# EAGLE design esp_thermometer (EAGLE 8.4.3)
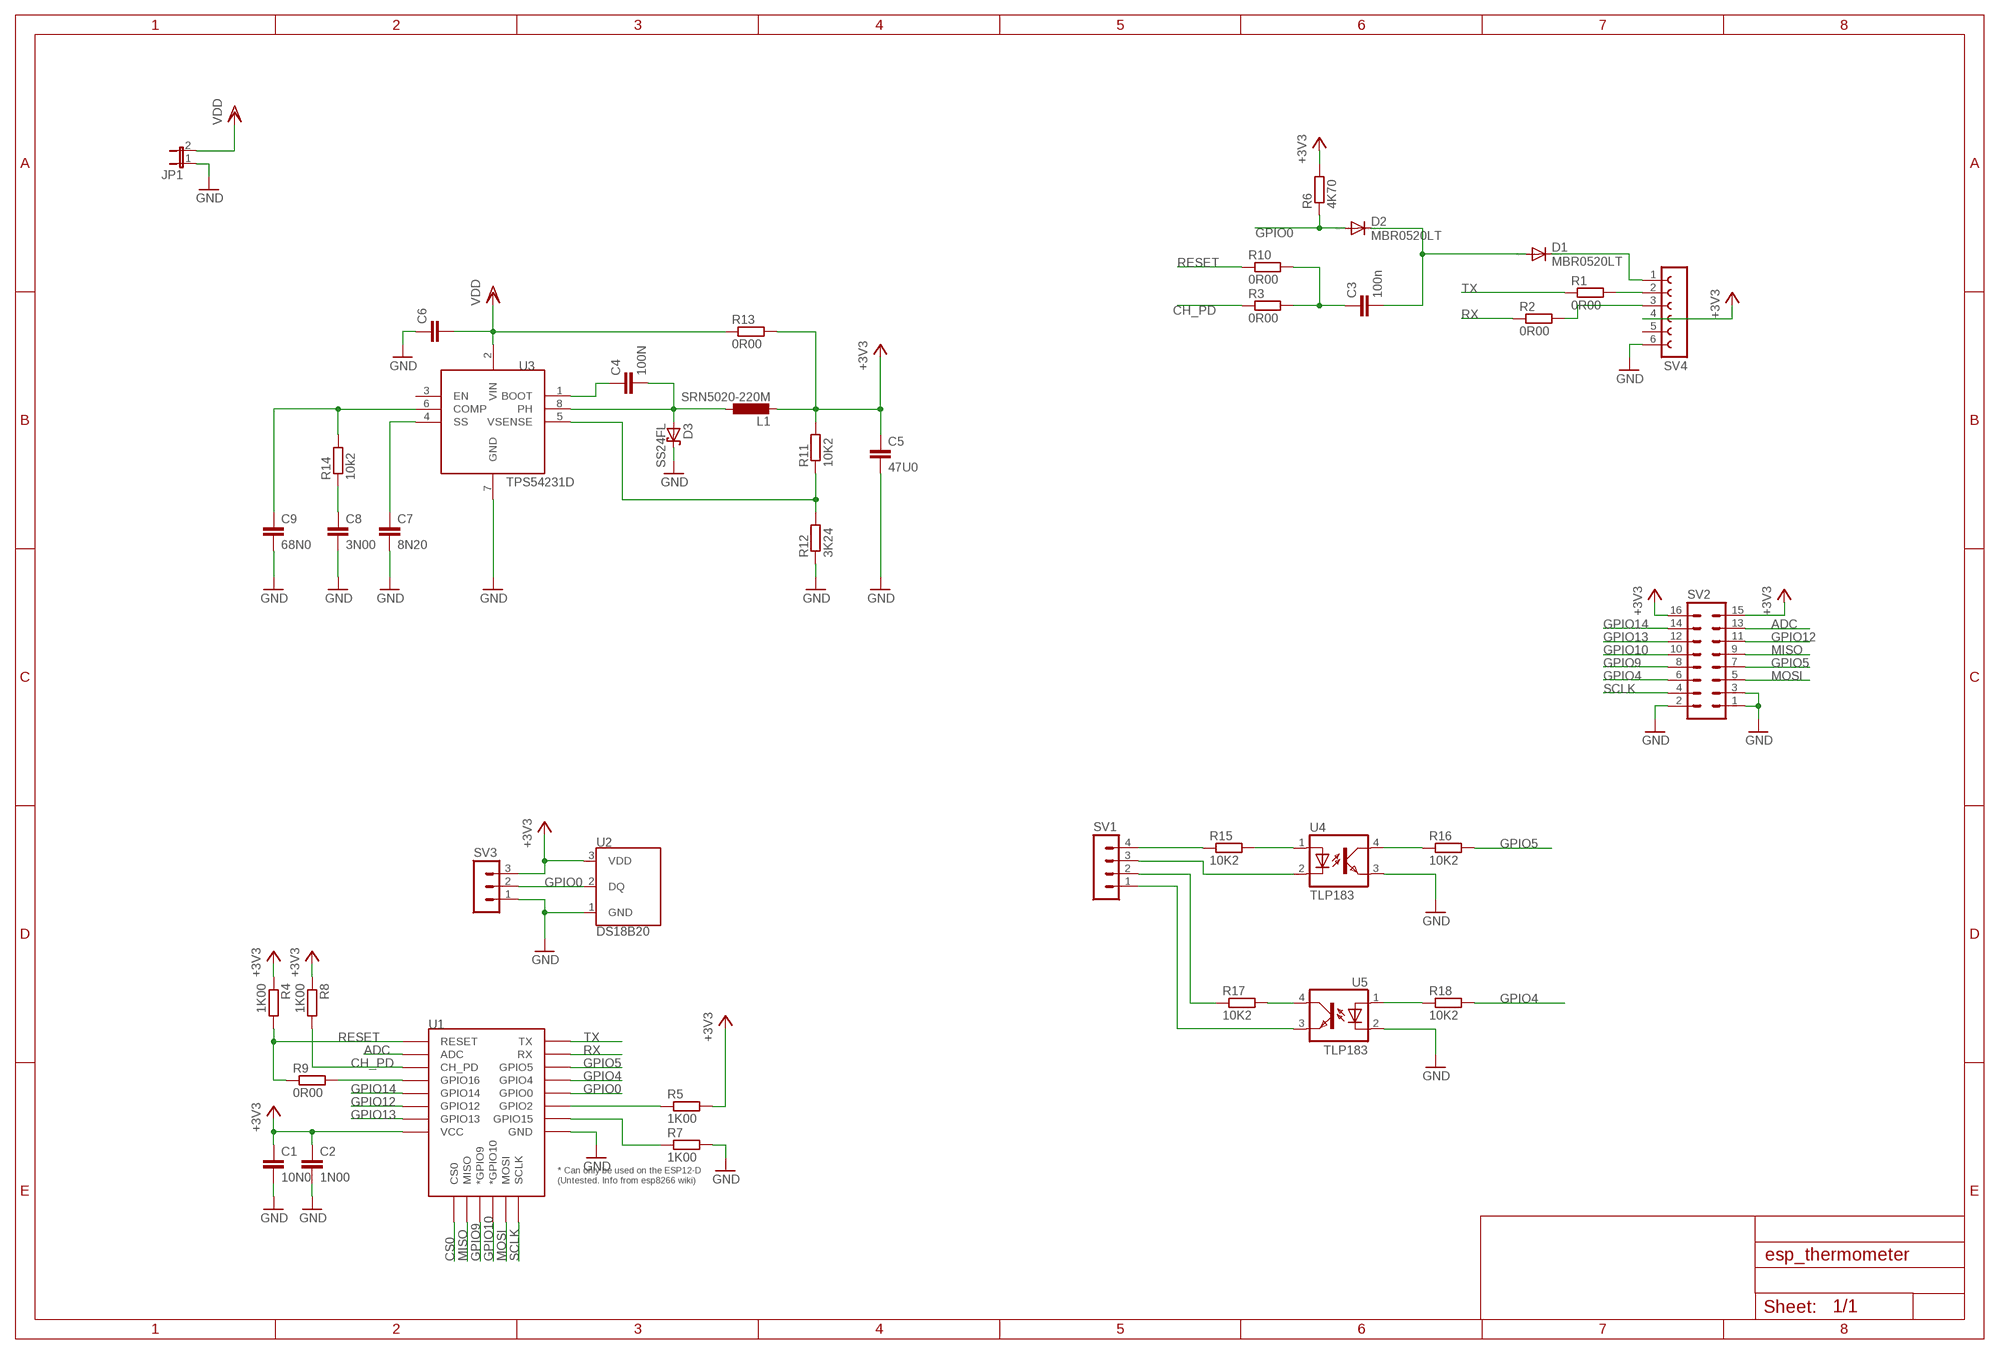
[diagram p0: schematic, sheet 1]

## Parts
C1  10N0  C-EUC1206K  [C1206K]
C2  1N00  C-EUC1206K  [C1206K]
C3  100n  C-EUC1206K  [C1206K]
C4  100N  C-EUC0805  [C0805]
C5  47U0  C-EUC1210  [C1210]
C6  C-EUC1210  [C1210]
C7  8N20  C-EUC0805  [C0805]
C8  3N00  C-EUC0805  [C0805]
C9  68N0  C-EUC0805  [C0805]
D1  MBR0520LT  [SOD123]
D2  MBR0520LT  [SOD123]
D3  SS24FL  [SOD-123_MINI-SMA]
JP1  JP1E  [JP1]
L1  SRN5020-220M  [L5050]
R1  0R00  R-EU_R0805  [R0805]
R2  0R00  R-EU_R0805  [R0805]
R3  0R00  R-EU_R0805  [R0805]
R4  1K00  R-EU_R0805  [R0805]
R5  1K00  R-EU_R0805  [R0805]
R6  4K70  R-EU_R0805  [R0805]
R7  1K00  R-EU_R0805  [R0805]
R8  1K00  R-EU_R0805  [R0805]
R9  0R00  R-EU_R0805  [R0805]
R10  0R00  R-EU_R0805  [R0805]
R11  10K2  R-EU_R0805  [R0805]
R12  3K24  R-EU_R0805  [R0805]
R13  0R00  R-EU_R0805  [R0805]
R14  10k2  R-EU_R0805  [R0805]
R15  10K2  R-EU_R0805  [R0805]
R16  10K2  R-EU_R0805  [R0805]
R17  10K2  R-EU_R0805  [R0805]
R18  10K2  R-EU_R0805  [R0805]
SV1  MA04-1  [MA04-1]
SV2  MA08-2  [MA08-2]
SV3  MA03-1  [MA03-1]
SV4  FE06-1  [FE06]
U1  ESP12ESMD  [ESP12E-SMD]
U2  DS18B20  [TO-92-AMMO]
U3  TPS54231D  [D0008A]
U4  TLP183  [MINI-FLAT-4]
U5  TLP183  [MINI-FLAT-4]

## Nets
+3V3: C1.1 C2.1 C5.1 L1.2 R4.1 R5.2 R6.2 R8.1 R11.2 R13.2 SV2.15 SV2.16 SV3.3 SV4.4 U1.VCC U2.3(VDD)
ADC: SV2.13 U1.ADC
CH_PD: R3.1 R8.2 U1.CH_PD
CS0: U1.CS0
GND: C1.2 C2.2 C5.2 C6.1 C7.2 C8.2 C9.2 D3.C JP1.1 R7.2 R12.1 SV2.1 SV2.2 SV2.3 SV3.1 SV4.6 U1.GND U2.1(GND) U3.7(GND) U4.3(EMIT) U5.2(C)
GPIO0: D2.A R6.1 SV3.2 U1.GPIO0 U2.2(DQ)
GPIO4: R18.2 SV2.6 U1.GPIO4
GPIO5: R16.2 SV2.7 U1.GPIO5
GPIO9: SV2.8 U1.GPIO9(*GPIO9)
GPIO10: SV2.10 U1.GPIO10(*GPIO10)
GPIO12: SV2.11 U1.GPIO12
GPIO13: SV2.12 U1.GPIO13
GPIO14: SV2.14 U1.GPIO14
MISO: SV2.9 U1.MISO
MOSI: SV2.5 U1.MOSI
N$1: R9.2 U1.GPIO16
N$2: C4.1 U3.1(BOOT)
N$3: R5.1 U1.GPIO2
N$4: R1.2 SV4.2
N$5: R7.1 U1.GPIO15
N$6: R15.2 U4.1(A)
N$7: R2.2 SV4.3
N$8: D1.C SV4.1
N$9: C3.2 D1.A D2.C
N$10: C3.1 R3.2 R10.2
N$11: R15.1 SV1.4
N$12: SV1.3 U4.2(C)
N$13: R11.1 R12.2 U3.5(VSENSE)
N$14: R17.1 SV1.2
N$15: C7.1 U3.4(SS)
N$16: C8.1 R14.1
N$17: C9.1 R14.2 U3.6(COMP)
N$18: R17.2 U5.4(COL)
N$19: R16.1 U4.4(COL)
N$20: SV1.1 U5.3(EMIT)
N$21: R18.1 U5.1(A)
PH: C4.2 D3.A L1.1 U3.8(PH)
RESET: R4.2 R9.1 R10.1 U1.RESET
RX: R2.1 U1.RXD0(RX)
SCLK: SV2.4 U1.SCLK
TX: R1.1 U1.TXD0(TX)
VDD: C6.2 JP1.2 R13.1 U3.2(VIN)
Unconnected: SV4.5 U3.3(EN)

## Library data of the parts
C1-C9 = rcl:C-EU: CAPACITOR, European symbol; SPICEPREFIX: C
D1 D2 = diode:MBR0520LT: SCHOTTKY BARRIER RECTIFIER Source: http://onsemi.com .. MBR0520LT1-D.pdf
D3 = slqlib:SS24FL
JP1 = jumper:JP1E: JUMPER
L1 = slqlib:SRN5020-220M
R1-R18 = rcl:R-EU_: RESISTOR, European symbol; SPICEPREFIX: R
SV1 = con-lstb:MA04-1: PIN HEADER; OC_FARNELL: unknown; OC_NEWARK: unknown
SV2 = con-lstb:MA08-2: PIN HEADER; OC_FARNELL: unknown; OC_NEWARK: unknown
SV3 = con-lstb:MA03-1: PIN HEADER; OC_FARNELL: unknown; OC_NEWARK: unknown
SV4 = con-lsta:FE06-1: FEMALE HEADER; OC_FARNELL: unknown; OC_NEWARK: unknown
U1 = esp8266modules:ESP12E: ESP12E Module
U2 = SparkFun-Sensors:DS18B20: Dallas/Maxim DS18B20 1-Wire Temperature Sensor The DS18B20 reports degrees C with 9 to 12-bit precision, -55C to 125C (+/-0.5C). Each sensor has a unique 64-Bit Serial number etched into it - allows for a huge number of sensors to be used on one data bus. Datasheet <http://datasheets.maximintegrated.com/en/ds/DS18B20.pdf> SparkFun Products One Wire Digital Temperature Sensor - DS18B20 <https://www.sparkfun.com/products/245> (SEN-00245); STORE_ID: SEN-00245
U3 = slqlib:TPS54231
U4 U5 = slqlib:TLP183: Toshiba TLP183 Optocoupler

## Board
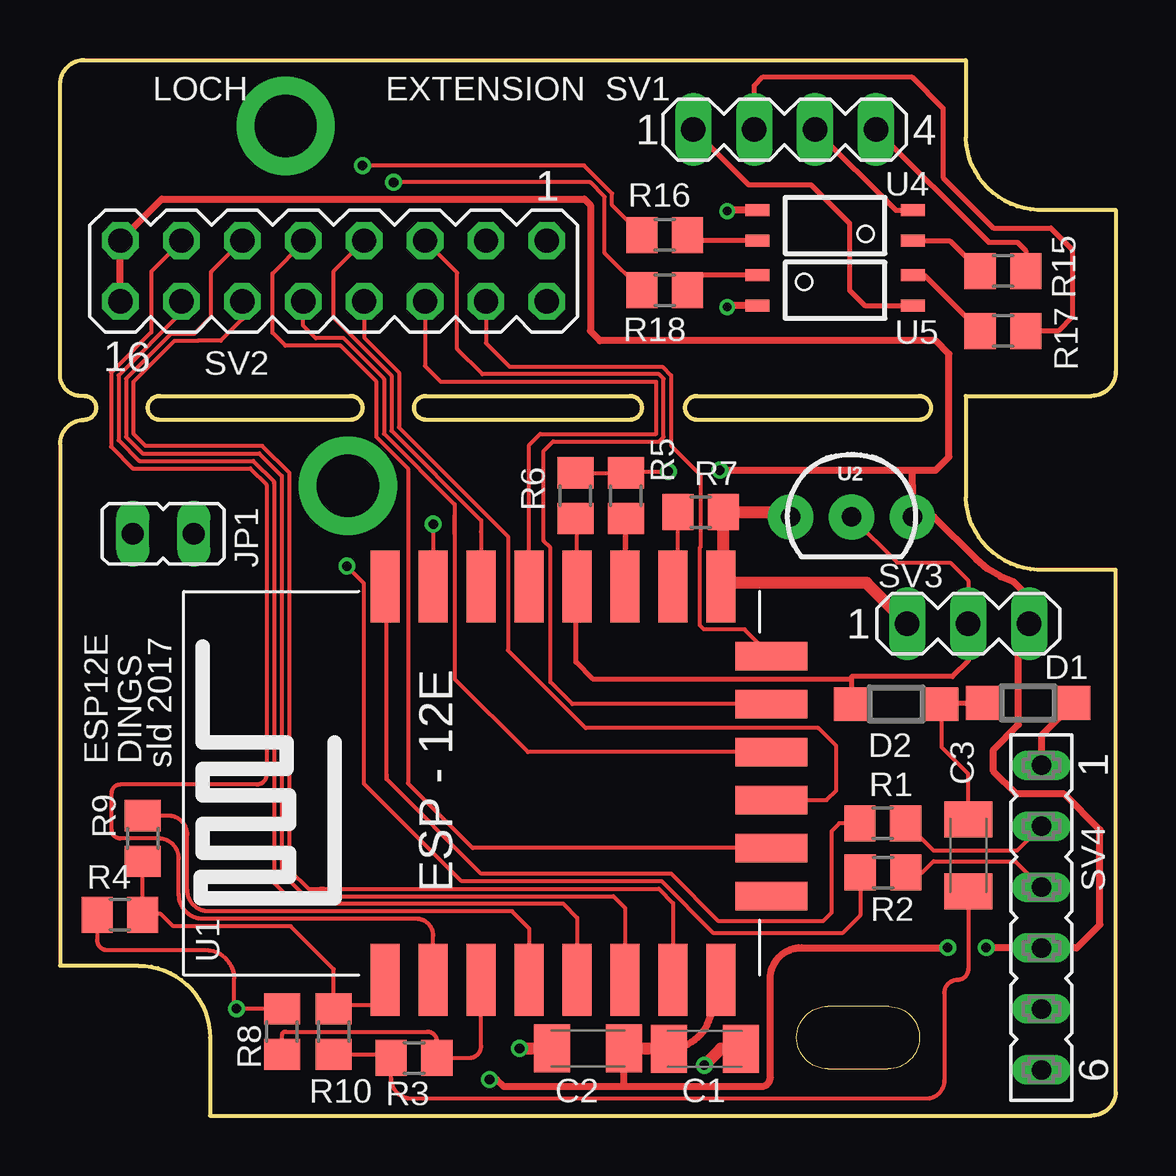
[diagram p1: board, top side]
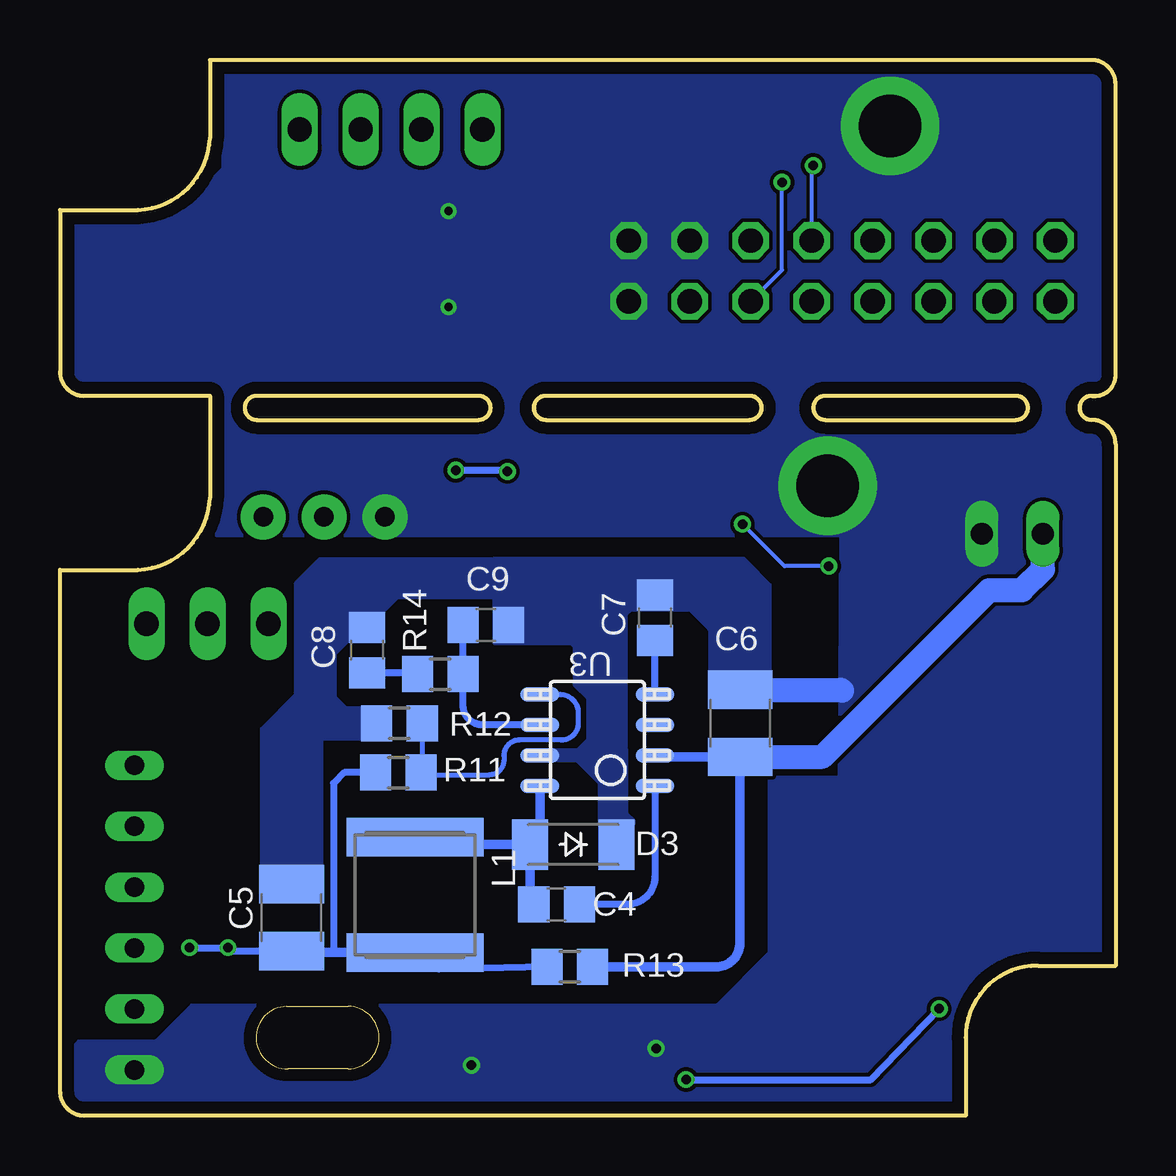
[diagram p2: board, bottom side, seen from below]

Size 44.01 x 44 mm. Coordinates in mm from the lower left corner, seen from the top.
Outline: 6.26,0 43.01,0 arc90 44.01,1 44.01,22.75 40.76,22.75 arc-85 37.76,25.75 37.76,30 43.01,30 arc90 44.01,31 44.01,37.75 40.76,37.75 arc-85 37.76,40.75 37.76,44 1.01,44 arc90 0.01,43 0.01,31 arc106 1.01,30 arc-180 1.01,29 arc90 0.01,28 0.01,6.25 3.26,6.25 arc-90 6.26,3.25 6.26,0
Outline: 35.81,29 26.56,29 arc-180 26.56,30 35.81,30 arc-180 35.81,29
Outline: 23.76,29 15.26,29 arc-180 15.26,30 23.76,30 arc-180 23.76,29
Outline: 12.11,29 4.16,29 arc-180 4.16,30 12.11,30 arc-180 12.11,29
Outline: 32.01,1.95 arc-180 32.01,4.55 34.56,4.55 arc-180 34.51,1.95 32.01,1.95
Copper layers (1*16): Top 0.035mm / dielectric 1.6mm / Bottom 0.035mm
Design rules "Elecrow_2-layer_PCB_eagle_rule": minimum track width 6mil, minimum drill 12mil, track to track 6mil, track to pad 8mil, pad to pad 12mil, via to via 12mil, smd to smd 0mil, copper to edge 20mil, drill to drill 10mil, minimum pad ring 6mil, minimum via ring 6mil, stop-mask expansion 0mil, vias tented up to drill 100mil, thermal gap 10mil

### Footprints (pad centres in the part's own frame; a part is rotated, then mirrored left to right if it is on the bottom)
C1206K = smd 1.5 x 2: 1 -1.5,0; 2 1.5,0
C0805 = smd 1.3 x 1.5: 1 -0.95,0; 2 0.95,0
C1210 = smd 1.6 x 2.7: 1 -1.4,0; 2 1.4,0
SOD123 = smd 1.4 x 1.4: A 1.9,0; C -1.9,0
SOD-123_MINI-SMA = smd 1.5 x 2.1: A 1.8,0; C -1.8,0
JP1 = drill 0.914 long: 1 0,-1.27; 2 0,1.27
L5050 = smd 1.6 x 5.7: 1 -2.4,0; 2 2.4,0
R0805 = smd 1.3 x 1.5: 1 -0.95,0; 2 0.95,0
MA04-1 = drill 1.016 long: 1 -3.81,0; 2 -1.27,0; 3 1.27,0; 4 3.81,0
MA08-2 = drill 1.016 octagon: 1 -8.89,-1.27; 2 -8.89,1.27; 3 -6.35,-1.27; 4 -6.35,1.27; 5 -3.81,-1.27; 6 -3.81,1.27; 7 -1.27,-1.27; 8 -1.27,1.27; 9 1.27,-1.27; 10 1.27,1.27; 11 3.81,-1.27; 12 3.81,1.27; 13 6.35,-1.27; 14 6.35,1.27; 15 8.89,-1.27; 16 8.89,1.27
MA03-1 = drill 1.016 long: 1 -2.54,0; 2 0,0; 3 2.54,0
FE06 = drill 0.813 long: 1 -6.35,0; 2 -3.81,0; 3 -1.27,0; 4 1.27,0; 5 3.81,0; 6 6.35,0
ESP12E-SMD = smd 3 x 1.2: ADC -8.3,3.8; CH_PD -8.3,1.8; GND 8.1,-8.2; GPIO0 8.1,-2.2; GPIO2 8.1,-4.2; GPIO4 8.1,-0.2; GPIO5 8.1,1.8; GPIO12 -8.3,-4.2; GPIO13 -8.3,-6.2; GPIO14 -8.3,-2.2; GPIO15 8.1,-6.2; GPIO16 -8.3,-0.2; RESET -8.3,5.8; RXD0 8.1,3.8; TXD0 8.1,5.8; VCC -8.3,-8.2 | smd 1.2 x 3: CS0 -4.8,-10.3; GPIO9 -0.8,-10.3; GPIO10 1.2,-10.3; MISO -2.8,-10.3; MOSI 3.2,-10.3; SCLK 5.2,-10.3
TO-92-AMMO = drill 0.813 pad 1.88: 1 -2.54,0; 2 0,0; 3 2.54,0
D0008A = smd 1.6 x 0.6: 1 -2.4,1.905; 2 -2.4,0.635; 3 -2.4,-0.635; 4 -2.4,-1.905; 5 2.4,-1.905; 6 2.4,-0.635; 7 2.4,0.635; 8 2.4,1.905
MINI-FLAT-4 = smd 1 x 0.5: 1 -3.24,0.635; 2 -3.24,-0.635; 3 3.24,-0.635; 4 3.24,0.635

### Placement (x,y rotation side)
C1  26.88,2.79 0 top
C2  22.01,2.8 180 top
C3  37.86,10.85 90 top
C4  23.31,8.8 180 bottom
C5  34.36,8.25 90 bottom
C6  15.66,16.35 270 bottom
C7  19.21,20.75 90 bottom
C8  31.21,19.4 90 bottom
C9  26.26,20.45 0 bottom
D1  40.36,17.2 180 top
D2  34.86,17.15 180 top
D3  22.61,11.3 180 bottom
JP1  4.31,24.25 90 top
L1  29.21,9.2 270 bottom
R1  34.3,12.18 0 top
R2  34.31,10.13 0 top
R3  14.76,2.4 180 top
R4  2.5,8.37 0 top
R5  23.59,25.84 90 top
R6  21.49,25.84 90 top
R7  26.71,25.15 0 top
R8  9.26,3.5 270 top
R9  3.46,11.55 90 top
R10  11.41,3.5 270 top
R11  29.91,14.3 180 bottom
R12  29.86,16.35 0 bottom
R13  22.76,6.2 180 bottom
R14  28.16,18.4 0 bottom
R15  39.31,35.2 180 top
R16  25.21,36.7 180 top
R17  39.31,32.7 180 top
R18  25.21,34.4 180 top
SV1  30.21,41.1 0 top
SV2  11.41,35.2 180 top
SV3  37.86,20.5 0 top
SV4  40.91,8.25 270 top
U1  19.36,13.95 90 top
U2  33,24.95 0 top
U3  21.61,15.65 180 bottom
U4  32.31,37.1 180 top
U5  32.31,34.4 0 top

### Tracks (layer width: path | path; a pad name or v marks a point on that pad's centre or on a via)
+3V3  (via drill 0.4)
  Top 0.16: R4.1 1.55,7.31 arc90 1.96,6.9 6.06,6.9 arc-90 7.26,5.7 7.26,4.5 | 7.26,4.5 v7.36,4.45 | R8.1 7.31,4.45 arc-90 7.26,4.5 | R6.2 R5.2 23.65,26.85 v25.36,26.85
  Top 0.3: 27.53,6.78 arc-90 27.51,6.8 27.51,5.7 arc90 U1.VCC 27.56,5.3 arc-90 27.16,4.9 27.16,4.57 arc-90 C1.1 | U2.3 36.44,24.95 38.2,23.19 38.68,22.78 39.22,22.46 39.73,22.26 40.4,21.6 SV3.3 39.96,20.06 39.96,16.3 38.91,15.25 38.91,14.35 39.86,13.4 41.86,13.4 43.35,11.91 43.35,7.95 42.38,6.98 SV4.4 arc90 40.89,7 v38.61,7 | 23.56,2.75 arc90 C2.1 23.51,1.25 23.46,1.2 | 23.46,1.2 29.21,1.2 arc90 29.61,1.6 29.61,5.7 arc-90 30.91,7 v37.01,7 | 23.46,1.2 18.51,1.2 18.21,1.5 v17.91,1.5 | SV2.16 SV2.15 4.25,38.2 21.86,38.2 22.11,37.95 22.11,32.7 22.51,32.3 36.51,32.3 37.06,31.75 37.06,27.45 36.51,26.9 35.54,26.9 | 35.54,26.27 U2.3 | U2.3 35.54,26.9 | v27.51,26.9 35.54,26.9
  Top 0.5: C2.1 25.02,2.8 C1.1
  Bottom 0.16: 35.42,25.07 U2.3
  Bottom 0.2: 32.51,6.8 arc90 32.61,6.9
  Bottom 0.3: 34.41,6.8 arc90 34.43,6.78 | R13.2 28.21,6.1 arc-90 28.61,6.5 28.91,6.5 arc90 L1.2 | R11.2 32.16,14.3 32.61,13.85 32.61,6.8 | 29.61,6.75 arc-90 29.66,6.8 | v17.91,1.5 10.21,1.5 v7.36,4.45 | 35.51,25.15 35.42,25.07 | C5.1 36.86,6.85 v37.01,7 v38.61,7 | v27.51,26.9 25.41,26.9 v25.36,26.85
  Bottom 0.4: C5.1 34.41,6.8 32.61,6.8 32.51,6.8 29.66,6.8 L1.2
ADC
  Top 0.16: U1.ADC 15.56,7.5 arc90 14.86,8.2 5.96,8.2 arc-90 4.96,9.2 4.96,10.7 arc90 4.11,11.55 2.51,11.55 arc-90 2.16,11.9 2.16,13.45 arc-90 2.51,13.8 8.21,13.8 arc90 8.61,14.2 8.61,26.3 7.93,26.98 3.03,26.98 2.13,27.88 2.13,30.98 3.81,32.65 3.81,35.18 5.06,36.43 SV2.13
CH_PD
  Top 0.16: R8.2 9.26,3.35 arc-90 9.41,3.5 15.31,3.5 arc-90 15.71,3.1 R3.1 17.06,2.4 arc90 17.56,2.9 U1.CH_PD
GND  (via drill 0.35, 0.4, 2.6 pad 4.1)
  Top 0.3: 28.34,2.75 C1.2 | U4.3 27.84,37.73 v27.81,37.7 | U5.2 27.87,33.77 v27.81,33.7
  Top 0.5: 27.66,22.15 U1.GND | 27.66,22.15 R7.2 30.26,25.15 U2.1 | 27.66,22.15 arc-90 27.71,22.2 33.62,22.2 SV3.1 | C2.2 v19.16,2.8 19.11,2.8 | C1.2 27.55,2.79 v26.86,2.1
  Bottom 0.3: 26.91,2.1 v26.86,2.1
  Bottom 1: 15.43,17.52 arc90 C6.1 11.46,17.75 11.41,17.7
  other vias: 12.01,26.25 9.41,41.25
  pour Bottom (no thermals): 22.71,19.7 22.56,19.55 21.31,19.55 21.31,23.2 25.91,23.2 25.91,19.7
  pour Bottom (no thermals): 20.11,12.15 21.51,12.15 21.51,13.85 22.36,14.7 22.46,14.8 24.56,14.8 24.66,14.9 24.66,15.15 24.56,15.25 20.41,15.25 20.41,12.6 20.11,12.3 20.11,12.2
  pour Bottom (no thermals): 20.41,15.2 20.41,20.9 20.21,21.1 17.76,21.1 17.06,20.4 16.91,20.25 16.91,18.25 14.41,18.25 14.41,22.1 15.36,23.05 15.46,23.15 15.51,23.2 22.81,23.2 22.81,19.8 22.56,19.55 22.56,17.95 22.01,17.4 22.01,15.65 22.51,15.15 20.46,15.15
  pour Bottom (no thermals): 25.91,21.6 29.96,21.6 30.71,20.85 30.71,19.8 32.01,19.8 32.56,19.25 32.56,17.45 32.11,17 31.21,17 31.21,15.7 33.71,15.7 34.16,16.15 34.16,18.75 34.16,22.2 33.16,23.2 25.86,23.2 25.91,23.15
  pour Bottom (no thermals): 33.11,10.4 33.11,17.55 34.16,17.55 35.61,16.1 35.61,10.4
  pour Bottom (no thermals): 43.21,3.1 40.01,3.1 38.51,4.6 16.61,4.6 14.41,6.8 14.41,14.1 11.51,14.1 11.41,28.7 0.71,28.7 0.21,28.2 0.21,6.9 0.61,6.5 4.51,6.5 6.51,4.5 6.51,0.7 7.01,0.2 43.21,0.2 43.61,0.6 43.61,2.7
  pour Bottom (no thermals): 0.61,32.5 43.81,32.5 43.81,30.8 43.21,30.2 37.71,30.2 37.51,30 37.51,24.2 0.61,24.2 0.61,28.6
  pour Bottom (no thermals): 0.61,32.5 0.61,43.2 1.11,43.7 21.51,43.7 21.51,32.5
  pour Bottom: 43.41,32.5 43.41,37.4 39.31,37.4 37.21,39.5 37.21,43.5 21.61,43.5 21.51,43.4 21.51,32.5
GPIO0
  Top 0.16: U2.2 34.9,23.05 37.11,23.05 37.86,22.3 SV3.2 | U1.GPIO0 21.56,24.82 R6.1
  Top 0.2: D2.A 32.96,17.7 33,17.74 33,18.2 | U1.GPIO0 21.51,22 21.51,18.9 22.21,18.2 33,18.2 | 33,18.2 33,18.3 37.21,18.3 37.86,18.95 SV3.2
GPIO4  (via drill 0.4)
  Top 0.16: SV2.6 15.22,31.24 15.87,30.59 24.85,30.59 24.85,28.41 20.02,28.41 19.56,27.95 U1.GPIO4 | R18.2 22.71,35.95 22.71,38.3 22.11,38.9 v13.91,38.9
  Bottom 0.16: SV2.6 13.91,35.24 v13.91,38.9
GPIO5  (via drill 0.4)
  Top 0.16: 17.56,24.3 U1.GPIO5 | 17.56,24.3 17.56,24.37 | SV2.7 11.41,35.2 11.41,33.26 13.82,30.85 13.82,28.55 17.56,24.81 17.56,24.3 | R16.2 23.02,37.94 23.02,38.43 21.85,39.6 v12.61,39.6
  Bottom 0.16: v12.61,39.6 12.68,39.53 SV2.7
GPIO9
  Top 0.16: SV2.8 12.68,32.43 14.13,30.98 14.13,28.68 18.68,24.14 18.68,19.39 21.92,16.15 31.61,16.15 32.36,15.4 32.36,13.55 31.96,13.15 U1.GPIO9
GPIO10
  Top 0.16: U1.GPIO10 19.51,15.15 16.46,18.2 16.46,24.25 | 16.46,24.25 16.46,25.03 | SV2.10 10.14,32.92 10.66,32.4 11.83,32.4 13.51,30.72 13.51,28.42 16.46,25.47 16.46,24.25
GPIO12
  Top 0.16: 9.38,9.97 10.22,9.14 23.07,9.14 23.56,8.65 U1.GPIO12 | 9.38,9.97 9.26,10.1 | SV2.11 6.3,35.17 6.31,35.16 6.31,33.3 5.61,32.6 4.64,32.6 2.76,30.72 2.76,28.28 3.44,27.6 8.31,27.6 9.25,26.66 9.25,10.11 9.38,9.97
GPIO13
  Top 0.16: U1.GPIO13 25.56,8.85 24.96,9.45 11.01,9.45 | 11.01,9.45 10.86,9.45 | SV2.12 7.6,33.19 6.71,32.3 5.75,32.3 5.74,32.29 4.77,32.29 3.07,30.59 3.07,28.41 3.57,27.91 8.44,27.91 9.56,26.79 9.56,10.25 10.36,9.45 11.01,9.45
GPIO14
  Top 0.16: 21.56,5.1 U1.GPIO14 21.56,8.25 20.98,8.82 9.78,8.82 8.92,9.69 8.92,26.35 | SV2.14 5.06,33.46 2.45,30.85 2.45,28.15 3.31,27.29 8.06,27.29 8.92,26.43 | 8.92,26.35 8.92,26.43 | 8.92,26.43 8.92,26.35
MISO
  Top 0.16: U1.MISO 17.21,11.15 14.51,13.85 14.51,26.98 13.2,28.29 13.2,30.59 11.7,32.09 9.4,32.09 8.86,32.63 8.86,35.1 10.14,36.38 SV2.9
MOSI
  Top 0.16: U1.MOSI 21.36,17.15 20.44,18.07 20.44,23.67 20.16,23.95 20.16,27.7 20.56,28.1 24.98,28.1 25.16,28.28 25.16,30.72 24.98,30.9 17.61,30.9 16.56,31.95 16.56,35.13 SV2.5
N$1
  Top 0.16: U1.GPIO16 19.56,7.8 18.85,8.51 6.2,8.51 arc-90 5.31,9.4 5.31,11.7 arc90 4.51,12.5 R9.2 arc-90 3.11,12.15
N$2
  Bottom 0.3: U3.1 19.21,9.95 arc90 20.36,8.8 C4.1
N$3
  Top 0.16: U1.GPIO2 23.56,25.16 R5.1 23.59,23.62
N$4
  Top 0.16: R1.2 35.28,12.18 36.41,11.05 39.9,11.05 SV4.2
N$5
  Top 0.16: U1.GPIO15 25.76,22.25 R7.1
N$6
  Top 0.2: U4.1 37.09,36.47 R15.2
N$7
  Top 0.16: R2.2 35.94,10.13 36.41,10.6 39.83,10.6 SV4.3
N$8
  Top 0.3: D1.C 40.91,15.85 SV4.1
N$9
  Top 0.16: C3.2 37.86,14.25 36.76,15.35 D2.C
  Top 0.2: D2.C 36.81,17.2 D1.A
N$10
  Top 0.16: R10.2 13.66,2.55 arc-90 R3.2 13.81,1.55 arc90 14.66,0.7 36.11,0.7 arc90 36.86,1.45 36.86,5.1 arc-90 37.41,5.65 arc90 37.86,6.1 C3.1
N$11
  Top 0.2: SV1.4 38.72,36.4 39.91,36.4 40.26,36.05 R15.1
N$12
  Top 0.2: SV1.3 34.84,37.73 U4.2
N$13
  Bottom 0.2: U3.5 23.16,17.55 arc90 22.41,16.8 22.41,16.35 arc90 23.11,15.65 24.86,15.65 arc-90 25.51,15 25.51,14.8 arc90 26.11,14.2 28.71,14.2 | 28.71,14.2 R11.1 | R12.2 28.91,14.4 arc-90 28.71,14.2
N$14
  Top 0.2: SV1.2 28.94,42.93 29.31,43.3 35.51,43.3 36.81,42 36.81,39.1 38.91,37 41.31,37 42.21,36.1 42.21,33.3 41.61,32.7 R17.1
N$15
  Bottom 0.3: U3.4 C7.1
N$16
  Bottom 0.3: R14.1 29.16,18.45 C8.1
N$17
  Bottom 0.3: U3.6 26.39,16.29 arc90 27.21,17.1 R14.2 C9.1
N$18
  Top 0.2: U5.4 36.02,35.03 R17.2
N$19
  Top 0.2: U4.4 26.39,36.47 R16.1
N$20
  Top 0.2: SV1.1 28.7,38.8 31.31,38.8 32.91,37.2 32.91,34.4 33.54,33.77 U5.3
N$21
  Top 0.2: U5.1 26.79,35.03 R18.1
PH
  Bottom 0.4: 29.81,11.4 29.61,11.6 L1.1 arc-90 28.91,11.3 D3.A | U3.8 24.01,11.7 arc90 D3.A | D3.A 24.41,8.95 arc-90 C4.2
RESET
  Top 0.16: R4.2 R9.1 | R4.2 arc-90 R4.2 | 13.56,6.8 U1.RESET 13.56,4.75 13.41,4.6 11.41,4.6 | 11.41,4.6 11.41,6.1 9.62,7.89 4.72,7.89 4.21,8.4 3.48,8.4 R4.2 | 11.41,4.6 R10.1
RX  (via drill 0.4)
  Top 0.16: 33.34,10.15 R2.1 33.36,8.35 32.61,7.6 27.25,7.6 25.09,9.76 16.75,9.76 12.68,13.83 12.68,22.18 v11.96,22.9 | v15.56,24.65 U1.RXD0
  Bottom 0.16: v11.96,22.9 13.81,22.9 v15.56,24.65
SCLK
  Top 0.16: U1.SCLK 28.54,20.27 26.84,20.27 26.68,20.43 26.68,23.67 26.71,23.7 26.71,26.7 25.47,27.94 25.47,30.85 25.11,31.21 18.75,31.21 17.76,32.2 SV2.4
TX
  Top 0.16: U1.TXD0 13.61,22 13.61,14.25 | 13.61,14.25 13.61,14.02 | R1.1 32.49,12.18 32.16,11.85 32.16,8.45 31.81,8.1 27.46,8.1 25.48,10.07 17.56,10.07 13.61,14.02 | 13.61,14.02 13.61,14.25
  Top 0.2: 13.51,22 arc-90 U1.TXD0
VDD
  Bottom 0.4: C6.2 15.71,14.9 | C6.2 19.14,14.95 U3.2 | C6.2 15.66,7.2 arc90 16.66,6.2 R13.1
  Bottom 1: 15.63,14.98 arc-90 C6.2 12.23,14.95 5.28,21.9 3.91,21.9 3.04,22.77 JP1.2

### Text on the board
tNames: LOCH | EXTENSION | ESP12E | DINGS | sld 2017